# EasyEDA schematic 1-Schematic_Sumo sensor.json
TITLE: Sheet_1; REV: 1.0; Date: 2023-01-23; Sheet: 1/1; Drawn By: davicampos2002; Company: Your Company
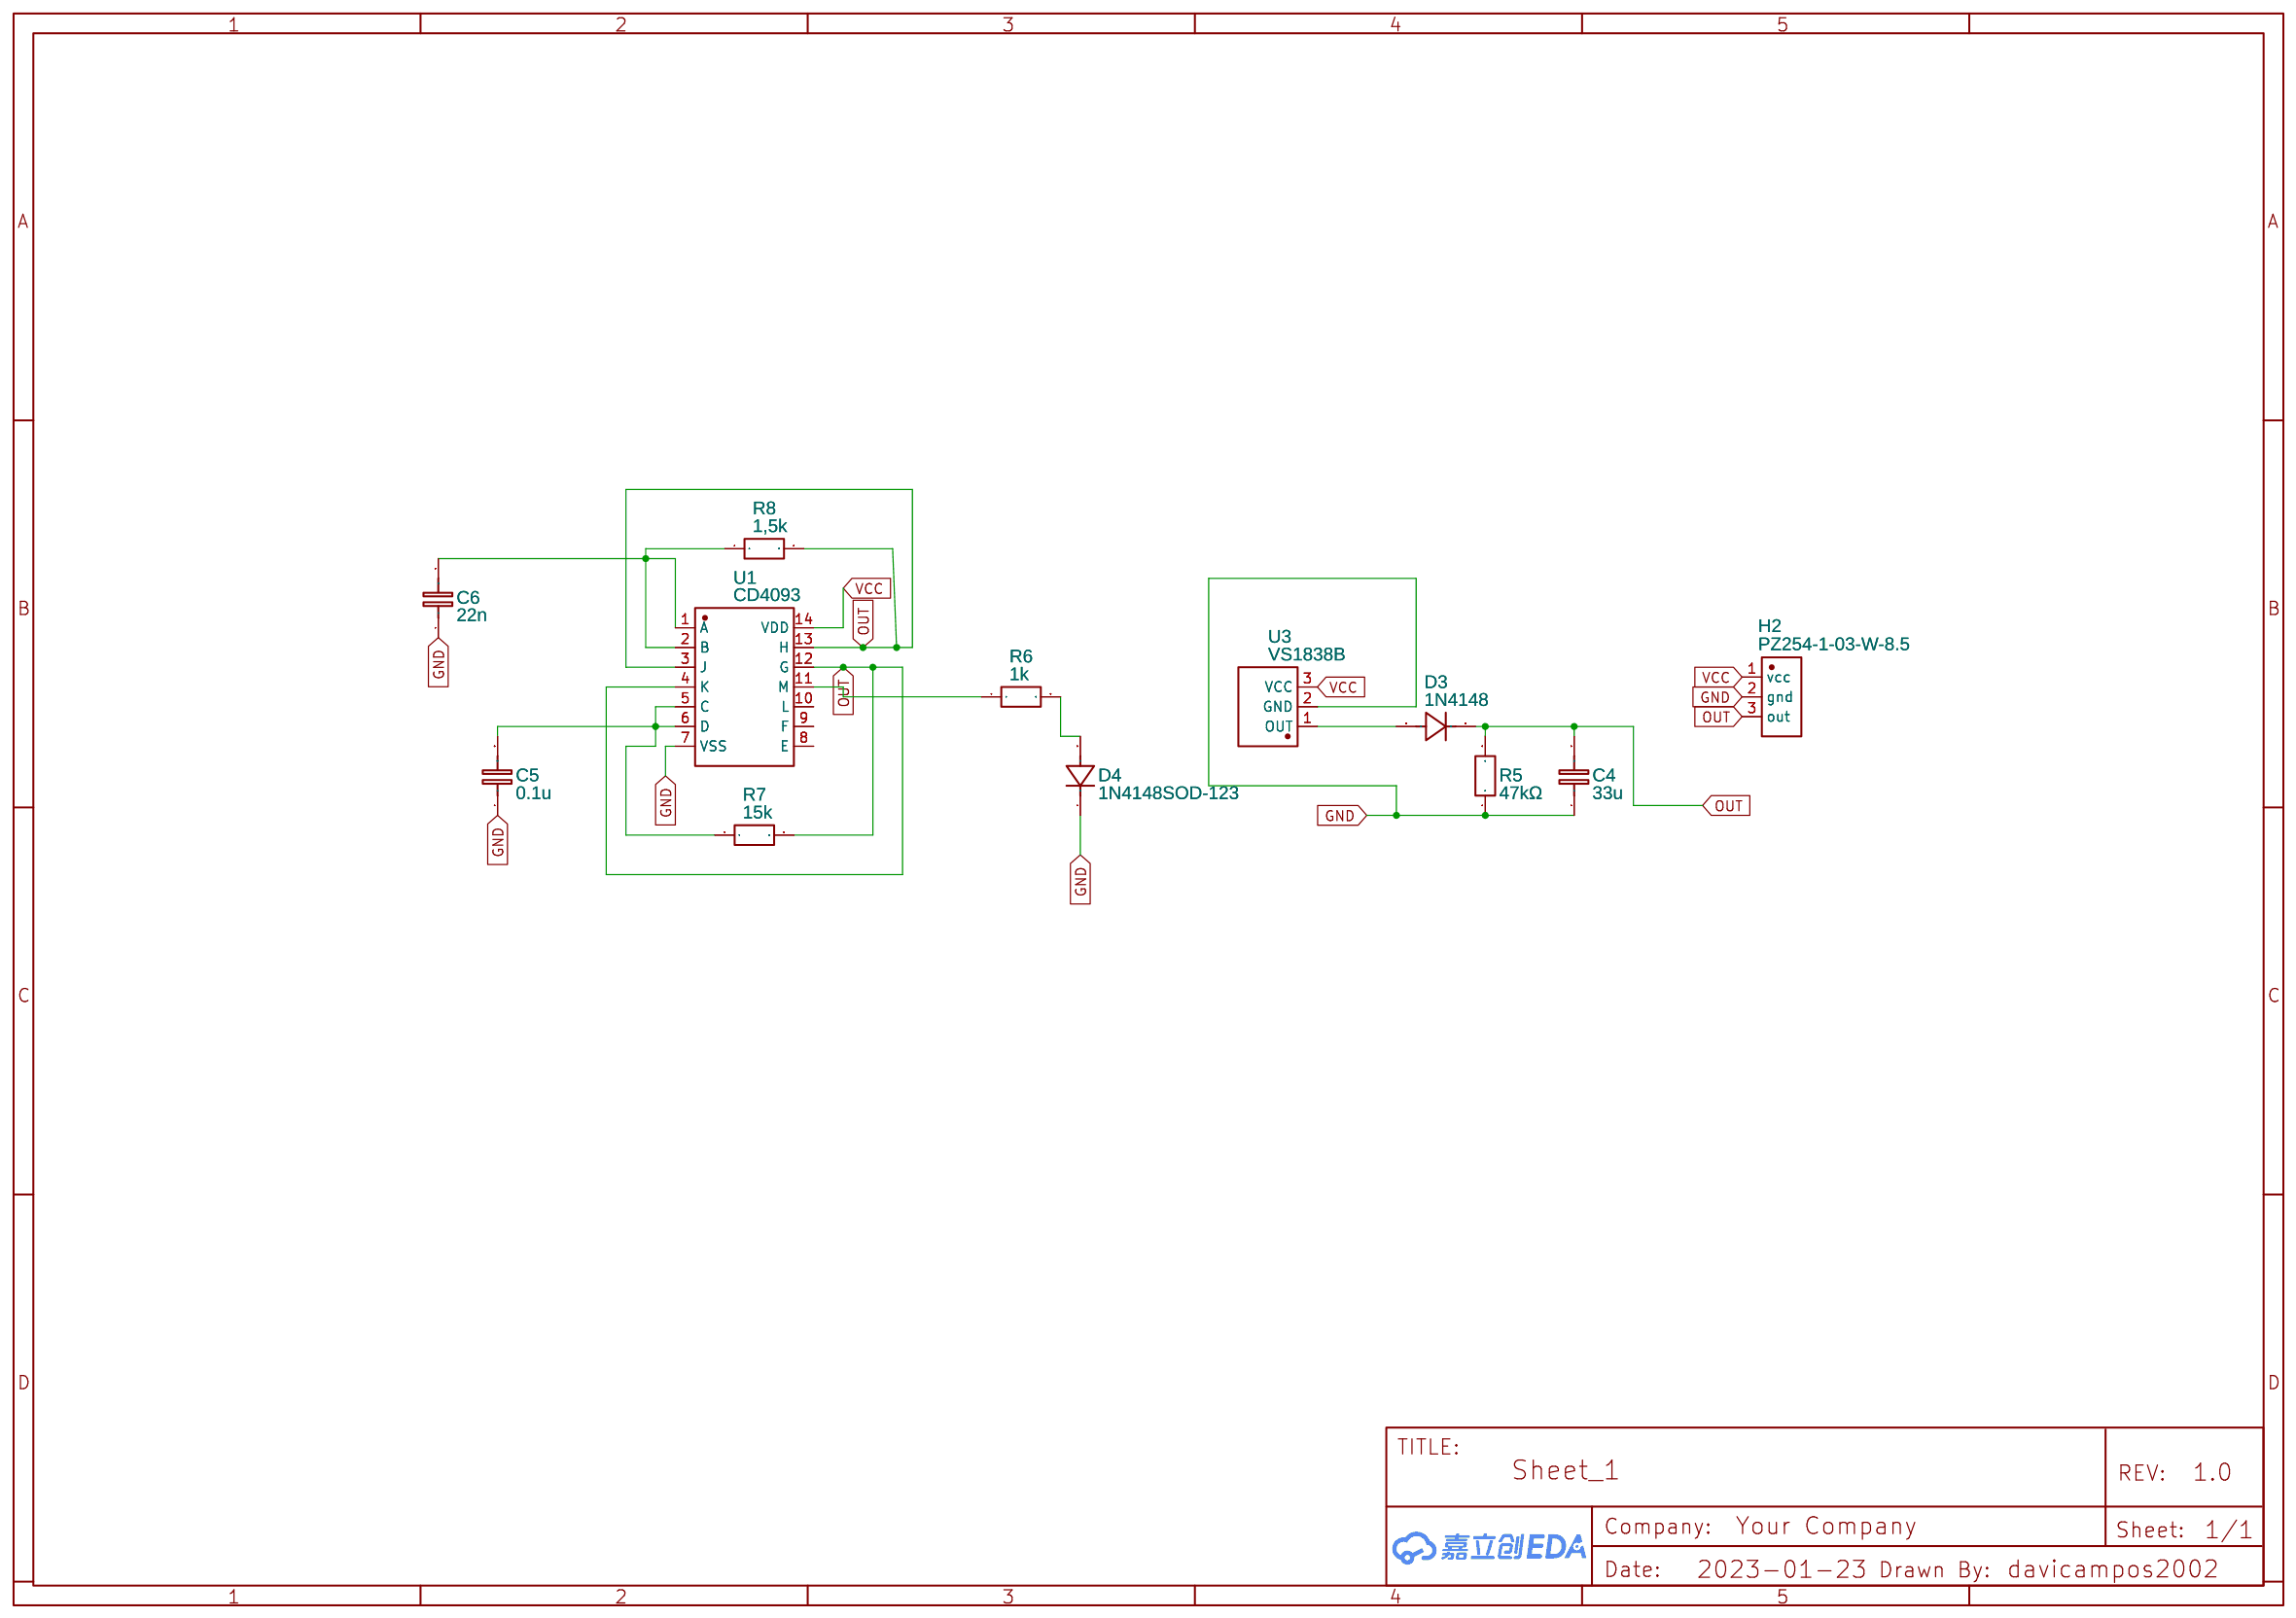
[diagram p0: schematic sheet]

## Parts
C4  33u  [C0603]
C5  0.1u  [C0603]
C6  22n  [C0603]
D3  1N4148  [SOD-123_L2.6-W1.6-LS3.5-RD]
D4  1N4148SOD-123  [SOD-123_L2.6-W1.6-LS3.5-RD]
H2  PZ254-1-03-W-8.5  [HDR-TH_03P-P2.54-H-M-W10.4-N]
R5  47kΩ  [R0402]
R6  1k  [R0603]
R7  15k  [R0603]
R8  1,5k  [R0603]
U1  CD4093  [SOP-14_L8.6-W3.9-P1.27-LS6.0-BL]
U3  VS1838B  [OPTO-TH_VS1838B]

## Library data of the parts
C4-C6 = C_0603_EU: Contributor: LCEDA_Lib
D3 D4 = 1N4148SOD-123: Supplier: LCSC; Supplier Part: C2972760; Manufacturer: JKSEMI(金开盛); Contributor: lcsc; JLCPCB Part Class: Extended Part
H2 = PZ254-1-03-W-8.5: Supplier: LCSC; Supplier Part: C2894945; Manufacturer: HCTL(华灿天禄); Contributor: LCSC; JLCPCB Part Class: Extended Part
R5 = SY0402JN47KP: Supplier: LCSC; Supplier Part: C380748; Manufacturer: SANYEAR(叁叶源); Resistance (Ohms): 47K; Contributor: LCSC; JLCPCB Part Class: Extended Part
R6-R8 = R_0603_EU: Contributor: LCEDA_Lib
U1 = CD4093: Supplier: LCSC; Supplier Part: C3041280; Manufacturer: Slkor(萨科微); link: https://atta.szlcsc.com/upload/public/pdf/source/20220623/53538C8114859BDF0941BFFB9BE04069.pdf; Contributor: lcsc
U3 = VS1838B: Supplier: LCSC; Supplier Part: C9900002107; Manufacturer: null; JLCPCB Part Class: Extended Part; Contributor: LCSC

## Nets
GND: C4.1 C5.1 C6.1 D4.1(K) H2.2(gnd) R5.1 U1.7(VSS) U3.2(GND)
VCC: H2.1(vcc) U1.14(VDD) U3.3(VCC)
OUT: C4.2 D3.1(K) H2.3(out) R5.2 R7.2 R8.2 U1.3(J) U1.4(K) U1.12(G) U1.13(H)
Net-(C5-2): C5.2 R7.1 U1.5(C) U1.6(D)
Net-(C6-2): C6.2 R8.1 U1.1(A) U1.2(B)
Net-(D3-2): D3.2(A) U3.1(OUT)
Net-(D4-2): D4.2(A) R6.2
Net-(R6-1): R6.1 U1.11(M)

Not connected (* = marked no-connect by the designer): U1 8(E) 9(F) 10(L)
